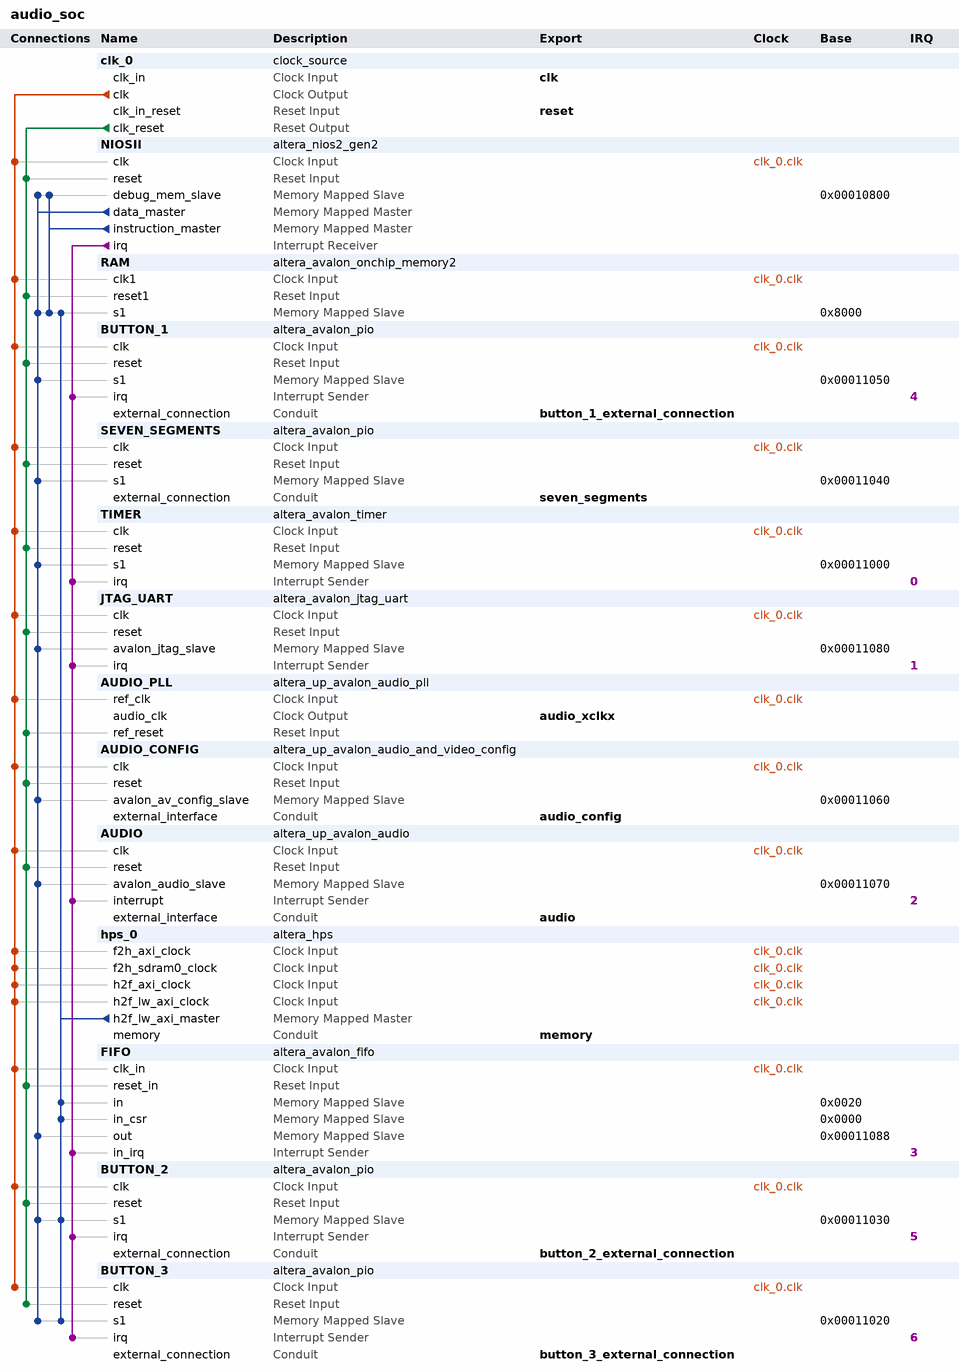
[diagram p0: system contents]
# Platform Designer (Qsys) system audio_soc, Cyclone V 5CSEMA5F31C6
# Parameters at their usual value, and those the tool derives, are not listed.
package require -exact qsys 18.1
create_system audio_soc
set_project_property DEVICE_FAMILY {Cyclone V}
set_project_property DEVICE 5CSEMA5F31C6

add_instance clk_0 clock_source 18.1
set_instance_parameter_value clk_0 clockFrequency 50000000

add_instance NIOSII altera_nios2_gen2 18.1
set_instance_parameter_value NIOSII dcache_size 2048
set_instance_parameter_value NIOSII exceptionSlave RAM.s1
set_instance_parameter_value NIOSII icache_size 4096
set_instance_parameter_value NIOSII impl Tiny
set_instance_parameter_value NIOSII resetSlave RAM.s1

add_instance RAM altera_avalon_onchip_memory2 18.1
set_instance_parameter_value RAM dataWidth 32
set_instance_parameter_value RAM dualPort false
set_instance_parameter_value RAM initMemContent true
set_instance_parameter_value RAM initializationFileName onchip_mem.hex
set_instance_parameter_value RAM memorySize 32768

add_instance BUTTON_1 altera_avalon_pio 18.1
set_instance_parameter_value BUTTON_1 bitClearingEdgeCapReg true
set_instance_parameter_value BUTTON_1 captureEdge true
set_instance_parameter_value BUTTON_1 direction Input
set_instance_parameter_value BUTTON_1 edgeType FALLING
set_instance_parameter_value BUTTON_1 generateIRQ true
set_instance_parameter_value BUTTON_1 irqType EDGE
set_instance_parameter_value BUTTON_1 width 1

add_instance SEVEN_SEGMENTS altera_avalon_pio 18.1
set_instance_parameter_value SEVEN_SEGMENTS direction Output
set_instance_parameter_value SEVEN_SEGMENTS width 28

add_instance TIMER altera_avalon_timer 18.1
set_instance_parameter_value TIMER fixedPeriod true
set_instance_parameter_value TIMER period 500
set_instance_parameter_value TIMER periodUnits MSEC

add_instance JTAG_UART altera_avalon_jtag_uart 18.1
set_instance_parameter_value JTAG_UART simInteractiveOptions NO_INTERACTIVE_WINDOWS

add_instance AUDIO_PLL altera_up_avalon_audio_pll 18.0
set_instance_parameter_value AUDIO_PLL gui_refclk 50.0

add_instance AUDIO_CONFIG altera_up_avalon_audio_and_video_config 18.0
set_instance_parameter_value AUDIO_CONFIG audio_in {Microphone to ADC}
set_instance_parameter_value AUDIO_CONFIG bit_length 24
set_instance_parameter_value AUDIO_CONFIG board DE1-SoC
set_instance_parameter_value AUDIO_CONFIG line_in_bypass false
set_instance_parameter_value AUDIO_CONFIG sampling_rate {48 kHz}

add_instance AUDIO altera_up_avalon_audio 18.0
set_instance_parameter_value AUDIO audio_in false
set_instance_parameter_value AUDIO avalon_bus_type {Memory Mapped}
set_instance_parameter_value AUDIO dw 24

add_instance hps_0 altera_hps 18.1
set_instance_parameter_value hps_0 EMAC1_Mode N/A
set_instance_parameter_value hps_0 EMAC1_PinMuxing Unused
set_instance_parameter_value hps_0 F2SCLK_COLDRST_Enable false
set_instance_parameter_value hps_0 F2SCLK_DBGRST_Enable false
set_instance_parameter_value hps_0 F2SCLK_WARMRST_Enable false
set_instance_parameter_value hps_0 F2SDRAM_Type AXI-3
set_instance_parameter_value hps_0 F2SDRAM_Width 64
set_instance_parameter_value hps_0 F2SINTERRUPT_Enable false
set_instance_parameter_value hps_0 F2S_Width 2
set_instance_parameter_value hps_0 FPGA_PERIPHERAL_OUTPUT_CLOCK_FREQ_EMAC0_GTX_CLK 125
set_instance_parameter_value hps_0 FPGA_PERIPHERAL_OUTPUT_CLOCK_FREQ_EMAC0_MD_CLK 2.5
set_instance_parameter_value hps_0 FPGA_PERIPHERAL_OUTPUT_CLOCK_FREQ_EMAC1_GTX_CLK 125
set_instance_parameter_value hps_0 FPGA_PERIPHERAL_OUTPUT_CLOCK_FREQ_EMAC1_MD_CLK 2.5
set_instance_parameter_value hps_0 HPS_PROTOCOL DDR3
set_instance_parameter_value hps_0 I2C0_Mode N/A
set_instance_parameter_value hps_0 I2C0_PinMuxing Unused
set_instance_parameter_value hps_0 I2C1_Mode N/A
set_instance_parameter_value hps_0 I2C1_PinMuxing Unused
set_instance_parameter_value hps_0 LWH2F_Enable true
set_instance_parameter_value hps_0 MEM_BANKADDR_WIDTH 3
set_instance_parameter_value hps_0 MEM_CLK_FREQ 300.0
set_instance_parameter_value hps_0 MEM_CLK_FREQ_MAX 400.0
set_instance_parameter_value hps_0 MEM_COL_ADDR_WIDTH 8
set_instance_parameter_value hps_0 MEM_DQ_WIDTH 8
set_instance_parameter_value hps_0 MEM_DRV_STR RZQ/6
set_instance_parameter_value hps_0 MEM_ROW_ADDR_WIDTH 12
set_instance_parameter_value hps_0 MEM_RTT_NOM {ODT Disabled}
set_instance_parameter_value hps_0 MEM_RTT_WR {Dynamic ODT off}
set_instance_parameter_value hps_0 MEM_TCL 7
set_instance_parameter_value hps_0 MEM_TFAW_NS 37.5
set_instance_parameter_value hps_0 MEM_TINIT_US 499
set_instance_parameter_value hps_0 MEM_TMRD_CK 3
set_instance_parameter_value hps_0 MEM_TRAS_NS 40.0
set_instance_parameter_value hps_0 MEM_TRCD_NS 15.0
set_instance_parameter_value hps_0 MEM_TREFI_US 7.0
set_instance_parameter_value hps_0 MEM_TRFC_NS 75.0
set_instance_parameter_value hps_0 MEM_TRP_NS 15.0
set_instance_parameter_value hps_0 MEM_TWTR 2
set_instance_parameter_value hps_0 MEM_VENDOR JEDEC
set_instance_parameter_value hps_0 MEM_WTCL 6
set_instance_parameter_value hps_0 MPU_EVENTS_Enable true
set_instance_parameter_value hps_0 QSPI_Mode N/A
set_instance_parameter_value hps_0 QSPI_PinMuxing Unused
set_instance_parameter_value hps_0 REF_CLK_FREQ 125.0
set_instance_parameter_value hps_0 S2FCLK_USER2CLK 5
set_instance_parameter_value hps_0 S2F_Width 2
set_instance_parameter_value hps_0 SDIO_Mode N/A
set_instance_parameter_value hps_0 SDIO_PinMuxing Unused
set_instance_parameter_value hps_0 SPIM1_Mode N/A
set_instance_parameter_value hps_0 SPIM1_PinMuxing Unused
set_instance_parameter_value hps_0 STM_Enable false
set_instance_parameter_value hps_0 TIMING_BOARD_AC_SKEW 0.02
set_instance_parameter_value hps_0 TIMING_BOARD_AC_TO_CK_SKEW 0.0
set_instance_parameter_value hps_0 TIMING_BOARD_DQ_TO_DQS_SKEW 0.0
set_instance_parameter_value hps_0 TIMING_BOARD_MAX_CK_DELAY 0.6
set_instance_parameter_value hps_0 TIMING_BOARD_MAX_DQS_DELAY 0.6
set_instance_parameter_value hps_0 TIMING_BOARD_SKEW_BETWEEN_DQS 0.02
set_instance_parameter_value hps_0 TIMING_BOARD_SKEW_CKDQS_DIMM_MAX 0.01
set_instance_parameter_value hps_0 TIMING_BOARD_SKEW_CKDQS_DIMM_MIN -0.01
set_instance_parameter_value hps_0 TIMING_BOARD_SKEW_WITHIN_DQS 0.02
set_instance_parameter_value hps_0 TIMING_TDH 125
set_instance_parameter_value hps_0 TIMING_TDQSCK 400
set_instance_parameter_value hps_0 TIMING_TDQSQ 120
set_instance_parameter_value hps_0 TIMING_TDS 50
set_instance_parameter_value hps_0 TIMING_TIH 250
set_instance_parameter_value hps_0 TIMING_TIS 175
set_instance_parameter_value hps_0 TIMING_TQSH 0.38
set_instance_parameter_value hps_0 UART0_Mode N/A
set_instance_parameter_value hps_0 UART0_PinMuxing Unused
set_instance_parameter_value hps_0 USB1_Mode N/A
set_instance_parameter_value hps_0 USB1_PinMuxing Unused
set_instance_parameter_value hps_0 desired_cfg_clk_mhz 100.0
set_instance_parameter_value hps_0 desired_qspi_clk_mhz 400.0

add_instance FIFO altera_avalon_fifo 18.1
set_instance_parameter_value FIFO bitsPerSymbol 16
set_instance_parameter_value FIFO channelWidth 8
set_instance_parameter_value FIFO errorWidth 8
set_instance_parameter_value FIFO fifoDepth 1024
set_instance_parameter_value FIFO fifoInputInterfaceOptions AVALONMM_WRITE
set_instance_parameter_value FIFO fifoOutputInterfaceOptions AVALONMM_READ
set_instance_parameter_value FIFO singleClockMode true
set_instance_parameter_value FIFO symbolsPerBeat 2
set_instance_parameter_value FIFO useIRQ true
set_instance_parameter_value FIFO usePacket true
set_instance_parameter_value FIFO useReadControl false

add_instance BUTTON_2 altera_avalon_pio 18.1
set_instance_parameter_value BUTTON_2 bitClearingEdgeCapReg true
set_instance_parameter_value BUTTON_2 captureEdge true
set_instance_parameter_value BUTTON_2 direction Input
set_instance_parameter_value BUTTON_2 edgeType FALLING
set_instance_parameter_value BUTTON_2 generateIRQ true
set_instance_parameter_value BUTTON_2 irqType EDGE
set_instance_parameter_value BUTTON_2 width 1

add_instance BUTTON_3 altera_avalon_pio 18.1
set_instance_parameter_value BUTTON_3 bitClearingEdgeCapReg true
set_instance_parameter_value BUTTON_3 captureEdge true
set_instance_parameter_value BUTTON_3 direction Input
set_instance_parameter_value BUTTON_3 edgeType FALLING
set_instance_parameter_value BUTTON_3 generateIRQ true
set_instance_parameter_value BUTTON_3 irqType EDGE
set_instance_parameter_value BUTTON_3 width 1

# connections
add_connection clk_0.clk AUDIO.clk clock
add_connection clk_0.clk AUDIO_CONFIG.clk clock
add_connection clk_0.clk AUDIO_PLL.ref_clk clock
add_connection clk_0.clk BUTTON_1.clk clock
add_connection clk_0.clk BUTTON_2.clk clock
add_connection clk_0.clk BUTTON_3.clk clock
add_connection clk_0.clk FIFO.clk_in clock
add_connection clk_0.clk hps_0.f2h_axi_clock clock
add_connection clk_0.clk hps_0.f2h_sdram0_clock clock
add_connection clk_0.clk hps_0.h2f_axi_clock clock
add_connection clk_0.clk hps_0.h2f_lw_axi_clock clock
add_connection clk_0.clk JTAG_UART.clk clock
add_connection clk_0.clk NIOSII.clk clock
add_connection clk_0.clk RAM.clk1 clock
add_connection clk_0.clk SEVEN_SEGMENTS.clk clock
add_connection clk_0.clk TIMER.clk clock
add_connection clk_0.clk_reset AUDIO.reset reset
add_connection clk_0.clk_reset AUDIO_CONFIG.reset reset
add_connection clk_0.clk_reset AUDIO_PLL.ref_reset reset
add_connection clk_0.clk_reset BUTTON_1.reset reset
add_connection clk_0.clk_reset BUTTON_2.reset reset
add_connection clk_0.clk_reset BUTTON_3.reset reset
add_connection clk_0.clk_reset FIFO.reset_in reset
add_connection clk_0.clk_reset JTAG_UART.reset reset
add_connection clk_0.clk_reset NIOSII.reset reset
add_connection clk_0.clk_reset RAM.reset1 reset
add_connection clk_0.clk_reset SEVEN_SEGMENTS.reset reset
add_connection clk_0.clk_reset TIMER.reset reset
add_connection hps_0.h2f_lw_axi_master BUTTON_2.s1 avalon
set_connection_parameter_value hps_0.h2f_lw_axi_master/BUTTON_2.s1 baseAddress 0x00011030
add_connection hps_0.h2f_lw_axi_master BUTTON_3.s1 avalon
set_connection_parameter_value hps_0.h2f_lw_axi_master/BUTTON_3.s1 baseAddress 0x00011020
add_connection hps_0.h2f_lw_axi_master FIFO.in avalon
set_connection_parameter_value hps_0.h2f_lw_axi_master/FIFO.in baseAddress 0x0020
add_connection hps_0.h2f_lw_axi_master FIFO.in_csr avalon
set_connection_parameter_value hps_0.h2f_lw_axi_master/FIFO.in_csr baseAddress 0x0000
add_connection hps_0.h2f_lw_axi_master RAM.s1 avalon
set_connection_parameter_value hps_0.h2f_lw_axi_master/RAM.s1 baseAddress 0x8000
add_connection NIOSII.data_master AUDIO.avalon_audio_slave avalon
set_connection_parameter_value NIOSII.data_master/AUDIO.avalon_audio_slave baseAddress 0x00011070
add_connection NIOSII.data_master AUDIO_CONFIG.avalon_av_config_slave avalon
set_connection_parameter_value NIOSII.data_master/AUDIO_CONFIG.avalon_av_config_slave baseAddress 0x00011060
add_connection NIOSII.data_master BUTTON_1.s1 avalon
set_connection_parameter_value NIOSII.data_master/BUTTON_1.s1 baseAddress 0x00011050
add_connection NIOSII.data_master BUTTON_2.s1 avalon
set_connection_parameter_value NIOSII.data_master/BUTTON_2.s1 baseAddress 0x00011030
add_connection NIOSII.data_master BUTTON_3.s1 avalon
set_connection_parameter_value NIOSII.data_master/BUTTON_3.s1 baseAddress 0x00011020
add_connection NIOSII.data_master FIFO.out avalon
set_connection_parameter_value NIOSII.data_master/FIFO.out baseAddress 0x00011088
add_connection NIOSII.data_master JTAG_UART.avalon_jtag_slave avalon
set_connection_parameter_value NIOSII.data_master/JTAG_UART.avalon_jtag_slave baseAddress 0x00011080
add_connection NIOSII.data_master NIOSII.debug_mem_slave avalon
set_connection_parameter_value NIOSII.data_master/NIOSII.debug_mem_slave baseAddress 0x00010800
add_connection NIOSII.data_master RAM.s1 avalon
set_connection_parameter_value NIOSII.data_master/RAM.s1 baseAddress 0x8000
add_connection NIOSII.data_master SEVEN_SEGMENTS.s1 avalon
set_connection_parameter_value NIOSII.data_master/SEVEN_SEGMENTS.s1 baseAddress 0x00011040
add_connection NIOSII.data_master TIMER.s1 avalon
set_connection_parameter_value NIOSII.data_master/TIMER.s1 baseAddress 0x00011000
add_connection NIOSII.instruction_master NIOSII.debug_mem_slave avalon
set_connection_parameter_value NIOSII.instruction_master/NIOSII.debug_mem_slave baseAddress 0x00010800
add_connection NIOSII.instruction_master RAM.s1 avalon
set_connection_parameter_value NIOSII.instruction_master/RAM.s1 baseAddress 0x8000
add_connection NIOSII.irq AUDIO.interrupt interrupt
set_connection_parameter_value NIOSII.irq/AUDIO.interrupt irqNumber 2
add_connection NIOSII.irq BUTTON_1.irq interrupt
set_connection_parameter_value NIOSII.irq/BUTTON_1.irq irqNumber 4
add_connection NIOSII.irq BUTTON_2.irq interrupt
set_connection_parameter_value NIOSII.irq/BUTTON_2.irq irqNumber 5
add_connection NIOSII.irq BUTTON_3.irq interrupt
set_connection_parameter_value NIOSII.irq/BUTTON_3.irq irqNumber 6
add_connection NIOSII.irq FIFO.in_irq interrupt
set_connection_parameter_value NIOSII.irq/FIFO.in_irq irqNumber 3
add_connection NIOSII.irq JTAG_UART.irq interrupt
set_connection_parameter_value NIOSII.irq/JTAG_UART.irq irqNumber 1
add_connection NIOSII.irq TIMER.irq interrupt
set_connection_parameter_value NIOSII.irq/TIMER.irq irqNumber 0

# exported interfaces
add_interface audio conduit end
set_interface_property audio EXPORT_OF AUDIO.external_interface
add_interface audio_config conduit end
set_interface_property audio_config EXPORT_OF AUDIO_CONFIG.external_interface
add_interface audio_xclkx clock source
set_interface_property audio_xclkx EXPORT_OF AUDIO_PLL.audio_clk
add_interface button_1_external_connection conduit end
set_interface_property button_1_external_connection EXPORT_OF BUTTON_1.external_connection
add_interface button_2_external_connection conduit end
set_interface_property button_2_external_connection EXPORT_OF BUTTON_2.external_connection
add_interface button_3_external_connection conduit end
set_interface_property button_3_external_connection EXPORT_OF BUTTON_3.external_connection
add_interface clk clock sink
set_interface_property clk EXPORT_OF clk_0.clk_in
add_interface memory conduit end
set_interface_property memory EXPORT_OF hps_0.memory
add_interface reset reset sink
set_interface_property reset EXPORT_OF clk_0.clk_in_reset
add_interface seven_segments conduit end
set_interface_property seven_segments EXPORT_OF SEVEN_SEGMENTS.external_connection

set_interconnect_requirement {$system} qsys_mm.clockCrossingAdapter HANDSHAKE
set_interconnect_requirement {$system} qsys_mm.enableEccProtection FALSE
set_interconnect_requirement {$system} qsys_mm.insertDefaultSlave FALSE
set_interconnect_requirement {$system} qsys_mm.maxAdditionalLatency 1

save_system audio_soc.qsys
